# Altium schematic sheet Sheet1.SchDoc: 2015级电气唐伟康-毕业设计
size A3
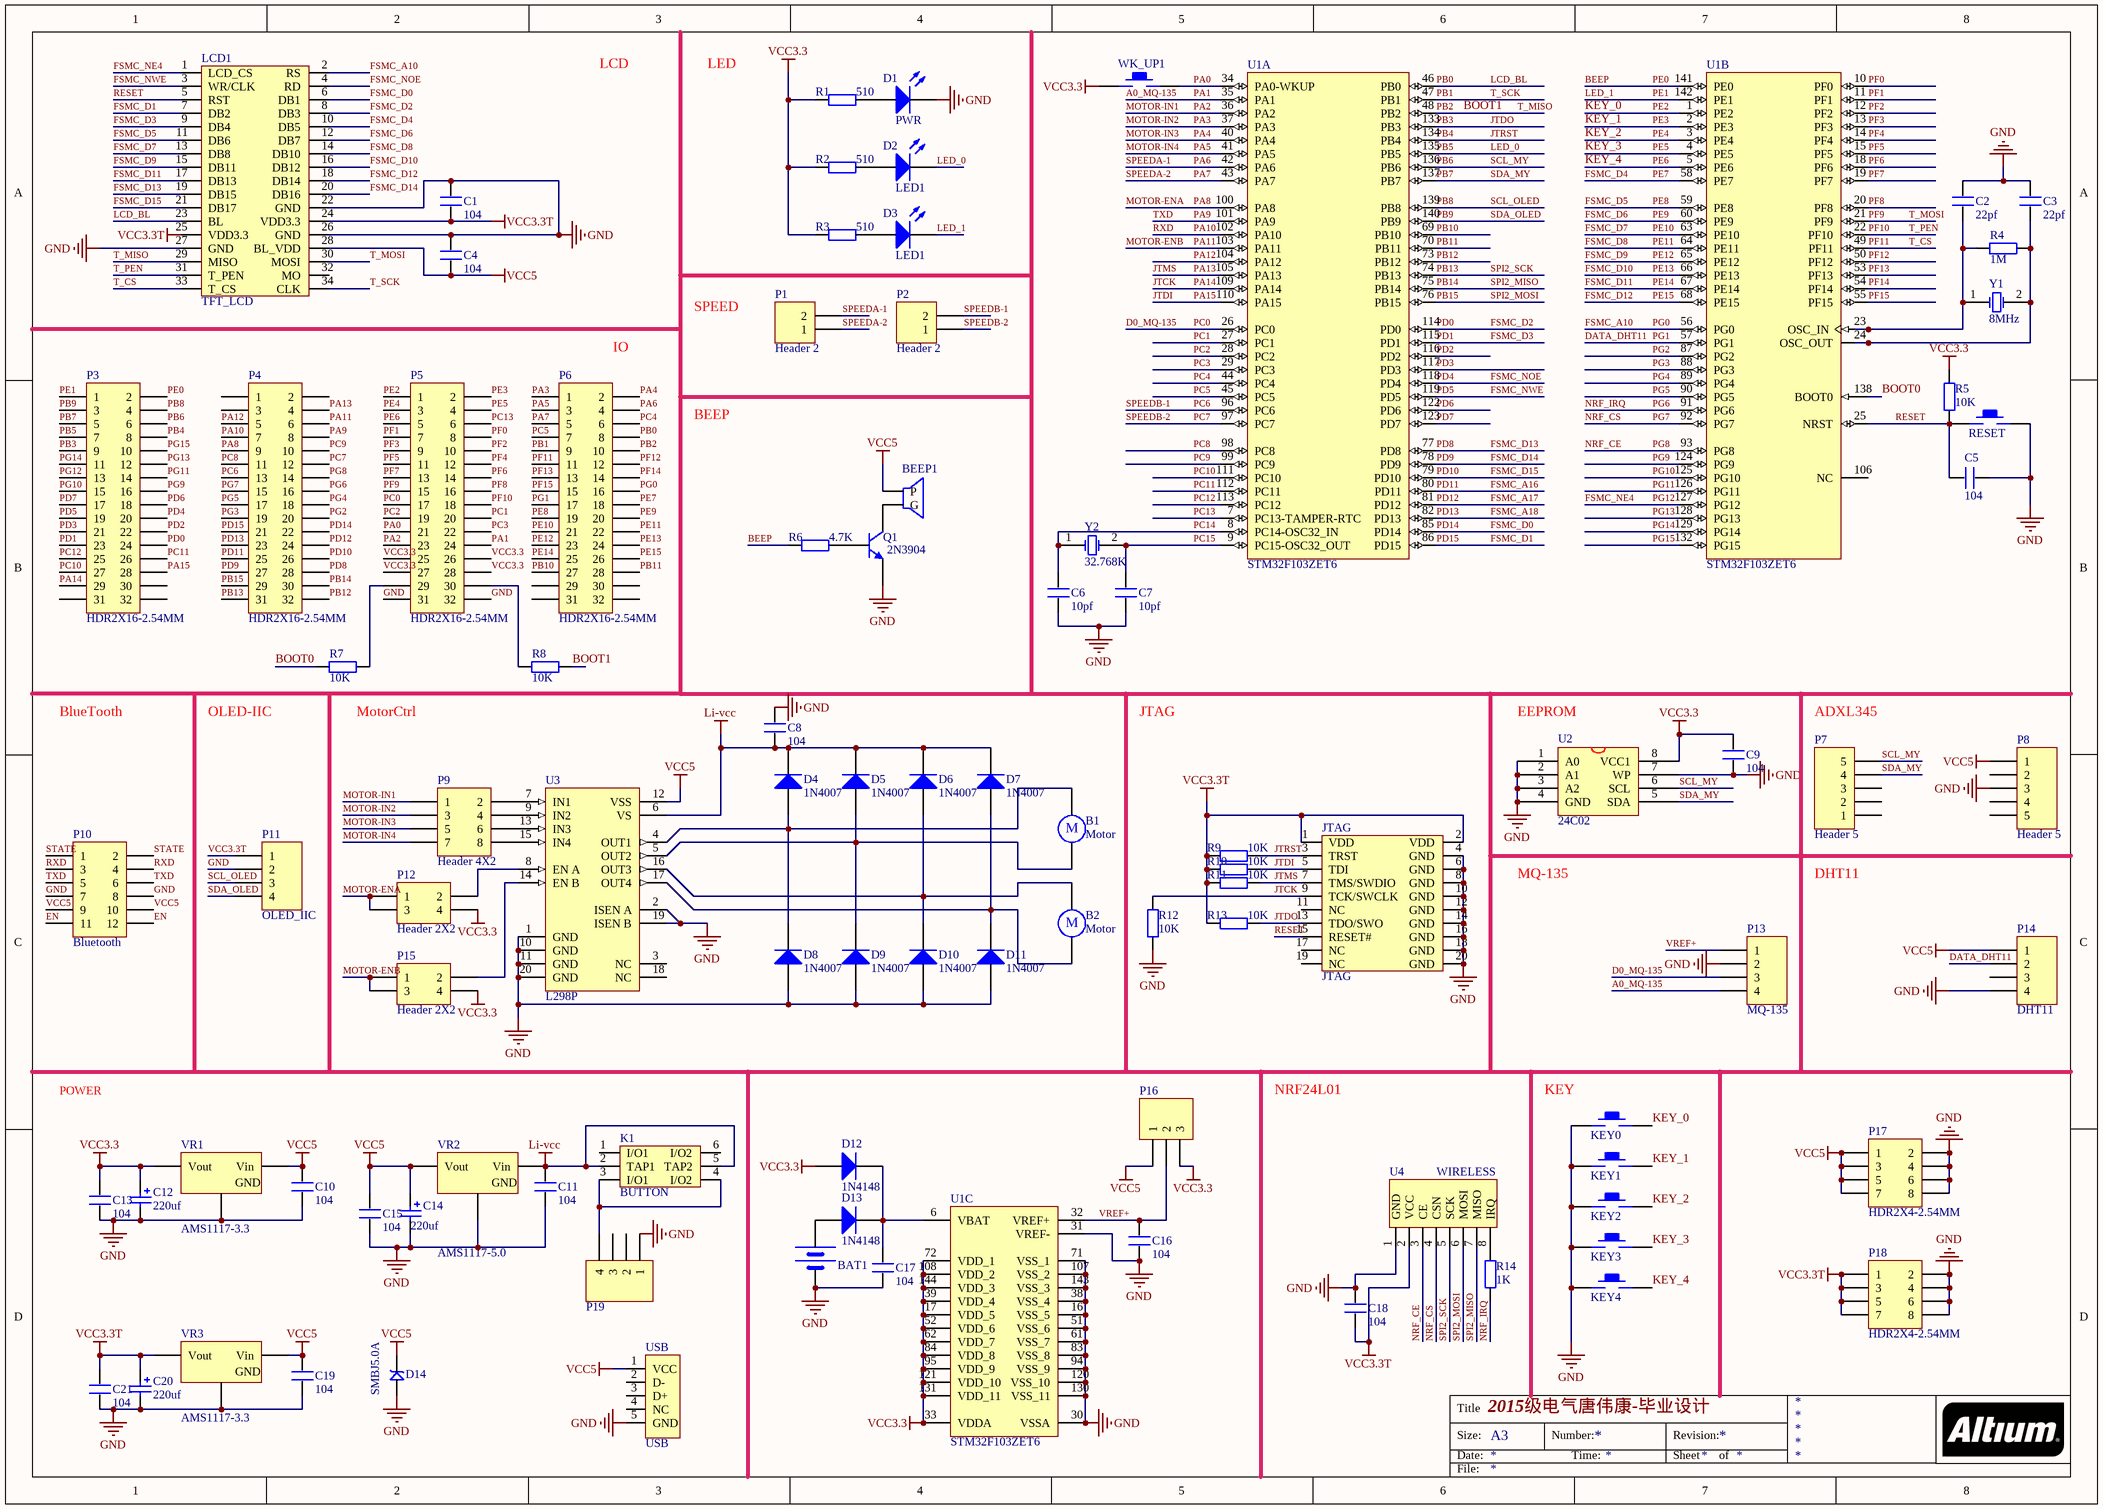
[diagram p0: Sheet1.SchDoc]

## Parts
B1  Motor  [RB5-10.5]
B2  Motor  [RB5-10.5]
BAT1  BATT  [BATM]  (value not drawn)
BEEP1  BEEP  [BELL-5]  (value not drawn)
C1  104  [0805]
C2  22pf  [0805]
C3  22pf  [0805]
C4  104  [0805]
C5  104  [0805]
C6  10pf  [0805]
C7  10pf  [0805]
C8  104  [0805]
C9  104  [0805]
C10  104  [0805]
C11  104  [0805]
C12  220uf  [C-DIP-6.3*15]
C13  104  [0805]
C14  220uf  [C-DIP-6.3*15]
C15  104  [0805]
C16  104  [0805]
C17  104  [0805]
C18  104  [0805]
C19  104  [0805]
C20  220uf  [C-DIP-6.3*15]
C21  104  [0805]
D1  PWR  [LED-1]
D2  LED1  [LED-1]
D3  LED1  [LED-1]
D4  1N4007  [DO-41]
D5  1N4007  [DO-41]
D6  1N4007  [DO-41]
D7  1N4007  [DO-41]
D8  1N4007  [DO-41]
D9  1N4007  [DO-41]
D10  1N4007  [DO-41]
D11  1N4007  [DO-41]
D12  1N4148  [DO-35]
D13  1N4148  [DO-35]
D14  SMBJ5.0A  [SMBJ]
JTAG  JTAG  [JTAG_20]
K1  BUTTON  [BTN8.5*8.5]
KEY0  KEY0  [KEY_M]  (value not drawn)
KEY1  KEY1  [KEY_M]  (value not drawn)
KEY2  KEY2  [KEY_M]  (value not drawn)
KEY3  KEY2  [KEY_M]  (value not drawn)
KEY4  KEY2  [KEY_M]  (value not drawn)
LCD1  TFT_LCD  [db2*17-4.3]
P1  Header 2  [HDR1X2]
P2  Header 2  [HDR1X2]
P3  HDR2X16-2.54MM  [HDR2X16-2.54MM]
P4  HDR2X16-2.54MM  [HDR2X16-2.54MM]
P5  HDR2X16-2.54MM  [HDR2X16-2.54MM]
P6  HDR2X16-2.54MM  [HDR2X16-2.54MM]
P7  Header 5  [HDR1X5]
P8  Header 5  [HDR1X5]
P9  Header 4X2  [HDR2X4]
P10  Bluetooth  [Header2X6-2.54MM]
P11  OLED_IIC  [Header1X4-2.54MM]
P12  Header 2X2  [HDR2X2]
P13  MQ-135  [Header1X4-2.54MM]
P14  DHT11  [Header1X4-2.54MM]
P15  Header 2X2  [HDR2X2]
P16  Header 3  [HDR1X3]  (value not drawn)
P17  HDR2X4-2.54MM  [HDR2X4-2.54MM]
P18  HDR2X4-2.54MM  [HDR2X4-2.54MM]
P19  Header1X4-2.54MM  [Header1X4-2.54MM]  (value not drawn)
Q1  2N3904  [TO-92A]
R1  value 510  [AXIAL-0.4]  (hidden comment: Res2)
R2  value 510  [AXIAL-0.4]  (hidden comment: Res2)
R3  value 510  [AXIAL-0.4]  (hidden comment: Res2)
R4  value 1M  [AXIAL-0.4]  (hidden comment: Res2)
R5  value 10K  [AXIAL-0.4]  (hidden comment: Res2)
R6  value 4.7K  [AXIAL-0.4]  (hidden comment: Res2)
R7  value 10K  [AXIAL-0.4]  (hidden comment: Res2)
R8  value 10K  [AXIAL-0.4]  (hidden comment: Res2)
R9  value 10K  [AXIAL-0.4]  (hidden comment: Res2)
R10  value 10K  [AXIAL-0.4]  (hidden comment: Res2)
R11  value 10K  [AXIAL-0.4]  (hidden comment: Res2)
R12  value 10K  [AXIAL-0.4]  (hidden comment: Res2)
R13  value 10K  [AXIAL-0.4]  (hidden comment: Res2)
R14  value 1K  [AXIAL-0.4]  (hidden comment: Res2)
RESET  RESET  [KEY_M]  (value not drawn)
U1  STM32F103ZET6  [STM-LQFP144_N]  (parts A,B,C of 3)
U2  24C02  [SOP-8]
U3  L298P  [PowerSO20_N]
U4  WIRELESS  [NRF24L01]
USB  USB  [USB/SM0.8-6H5]
VR1  AMS1117-3.3  [SOT-223]
VR2  AMS1117-5.0  [SOT-223]
VR3  AMS1117-3.3  [SOT-223]
WK_UP1  WK_UP  [KEY_M]  (value not drawn)
Y1  8MHz  [XTAL_US]
Y2  32.768K  [R38]

## Nets
GND: BAT1.2(GND) C1.2 C2.2 C3.2 C4.2 C5.2 C6.1 C7.1 C8.2 C9.2 C10.1 C11.1 C12.2 C13.1 C14.2 C15.1 C16.1 C17.1 C18.1 C19.1 C20.2 C21.1 D1.2(K) D8.1(A) D9.1(A) D10.1(A) D11.1(A) D14.1 JTAG.4(GND) JTAG.6(GND) JTAG.8(GND) JTAG.10(GND) JTAG.12(GND) JTAG.14(GND) JTAG.16(GND) JTAG.18(GND) JTAG.20(GND) KEY0.1 KEY1.1 KEY2.1 KEY3.1 KEY4.1 LCD1.22(GND) LCD1.26(GND) LCD1.27(GND) P5.31 P5.32 P8.3 P10.7 P10.8 P11.2 P13.2 P14.4 P17.2 P17.4 P17.6 P17.8 P18.2 P18.4 P18.6 P18.8 P19.1 Q1.1(E) R12.1 RESET.2 U1.16(VSS_5) U1.30(VSSA) U1.31(VREF-) U1.38(VSS_4) U1.51(VSS_6) U1.61(VSS_7) U1.71(VSS_1) U1.83(VSS_8) U1.94(VSS_9) U1.107(VSS_2) U1.120(VSS_10) U1.130(VSS_11) U1.143(VSS_3) U2.1(A0) U2.2(A1) U2.3(A2) U2.4(GND) U2.7(WP) U3.1(GND) U3.2(ISEN_A) U3.10(GND) U3.11(GND) U3.19(ISEN_B) U3.20(GND) U4.1(GND) USB.5(GND) VR1.1(GND) VR2.1(GND) VR3.1(GND)
Li-vcc: C8.1 C11.2 D4.2(K) D5.2(K) D6.2(K) D7.2(K) K1.2(TAP1) K1.5(TAP2) U3.6(VS) VR2.3(Vin)
VCC3.3: C9.1 C12.1 C13.2 D12.1(A) P5.25 P5.26 P5.27 P5.28 P12.4 P15.4 P16.3 R1.2 R2.2 R3.2 R5.2 U1.17(VDD_5) U1.33(VDDA) U1.39(VDD_4) U1.52(VDD_6) U1.62(VDD_7) U1.72(VDD_1) U1.84(VDD_8) U1.95(VDD_9) U1.108(VDD_2) U1.121(VDD_10) U1.131(VDD_11) U1.144(VDD_3) U2.8(VCC1) VR1.2(Vout) WK_UP1.1
VCC3.3T: C1.1 C18.2 C20.1 C21.2 JTAG.1(VDD) JTAG.2(VDD) LCD1.24(VDD3.3) LCD1.25(VDD3.3) P11.1 P18.1 P18.3 P18.5 P18.7 R9.2 R10.2 R11.2 R13.2 U4.2(VCC) VR3.2(Vout)
VCC5: BEEP1.1(P) C4.1 C10.2 C14.1 C15.2 C19.2 D14.2 LCD1.28(BL_VDD) P8.1 P10.9 P10.10 P14.1 P16.1 P17.1 P17.3 P17.5 P17.7 U3.12(VSS) USB.1(VCC) VR1.3(Vin) VR2.2(Vout) VR3.3(Vin)
A0_MQ-135: P5.24 P13.4 U1.35(PA1)  [also labelled PA1]
BEEP: P3.2 R6.2 U1.141(PE0)  [also labelled PE0]
BOOT0: R7.2 U1.138(BOOT0)
BOOT1: LCD1.29(MISO) P6.10 R8.1 U1.48(PB2)  [also labelled PB2, T_MISO]
D0_MQ-135: P5.17 P13.3 U1.26(PC0)  [also labelled PC0]
DATA_DHT11: P6.17 P14.2 U1.57(PG1)  [also labelled PG1]
EN: P10.11 P10.12
FSMC_A10: LCD1.2(RS) P6.16 U1.56(PG0)  [also labelled PG0]
FSMC_A16: P4.25 U1.80(PD11)  [also labelled PD11]
FSMC_A17: P4.24 U1.81(PD12)  [also labelled PD12]
FSMC_A18: P4.23 U1.82(PD13)  [also labelled PD13]
FSMC_D0: LCD1.6(DB1) P4.22 U1.85(PD14)  [also labelled PD14]
FSMC_D1: LCD1.7(DB2) P4.21 U1.86(PD15)  [also labelled PD15]
FSMC_D2: LCD1.8(DB3) P3.24 U1.114(PD0)  [also labelled PD0]
FSMC_D3: LCD1.9(DB4) P3.23 U1.115(PD1)  [also labelled PD1]
FSMC_D4: LCD1.10(DB5) P6.18 U1.58(PE7)  [also labelled PE7]
FSMC_D5: LCD1.11(DB6) P6.19 U1.59(PE8)  [also labelled PE8]
FSMC_D6: LCD1.12(DB7) P6.20 U1.60(PE9)  [also labelled PE9]
FSMC_D7: LCD1.13(DB8) P6.21 U1.63(PE10)  [also labelled PE10]
FSMC_D8: LCD1.14(DB10) P6.22 U1.64(PE11)  [also labelled PE11]
FSMC_D9: LCD1.15(DB11) P6.23 U1.65(PE12)  [also labelled PE12]
FSMC_D10: LCD1.16(DB12) P6.24 U1.66(PE13)  [also labelled PE13]
FSMC_D11: LCD1.17(DB13) P6.25 U1.67(PE14)  [also labelled PE14]
FSMC_D12: LCD1.18(DB14) P6.26 U1.68(PE15)  [also labelled PE15]
FSMC_D13: LCD1.19(DB15) P4.28 U1.77(PD8)  [also labelled PD8]
FSMC_D14: LCD1.20(DB16) P4.27 U1.78(PD9)  [also labelled PD9]
FSMC_D15: LCD1.21(DB17) P4.26 U1.79(PD10)  [also labelled PD10]
FSMC_NE4: LCD1.1(LCD_CS) P3.13 U1.127(PG12)  [also labelled PG12]
FSMC_NOE: LCD1.4(RD) P3.20 U1.118(PD4)  [also labelled PD4]
FSMC_NWE: LCD1.3(WR/CLK) P3.19 U1.119(PD5)  [also labelled PD5]
JTCK: JTAG.9(TCK/SWCLK) P3.29 R12.2 U1.109(PA14)  [also labelled PA14]
JTDI: JTAG.5(TDI) P3.28 R10.1 U1.110(PA15)  [also labelled PA15]
JTDO: JTAG.13(TDO/SWO) P3.9 R13.1 U1.133(PB3)  [also labelled PB3]
JTMS: JTAG.7(TMS/SWDIO) P4.4 R11.1 U1.105(PA13)  [also labelled PA13]
JTRST: JTAG.3(TRST) P3.8 R9.1 U1.134(PB4)  [also labelled PB4]
KEY_0: KEY0.2 P5.1 U1.1(PE2)  [also labelled PE2]
KEY_1: KEY1.2 P5.2 U1.2(PE3)  [also labelled PE3]
KEY_2: KEY2.2 P5.3 U1.3(PE4)  [also labelled PE4]
KEY_3: KEY3.2 P5.4 U1.4(PE5)  [also labelled PE5]
KEY_4: KEY4.2 P5.5 U1.5(PE6)  [also labelled PE6]
LCD_BL: LCD1.23(BL) P6.8 U1.46(PB0)  [also labelled PB0]
LED_0: D2.2(K) P3.7 U1.135(PB5)  [also labelled PB5]
LED_1: D3.2(K) P3.1 U1.142(PE1)  [also labelled PE1]
MOTOR-ENA: P4.9 P12.1 P12.3 U1.100(PA8)  [also labelled PA8]
MOTOR-ENB: P4.6 P15.1 P15.3 U1.103(PA11)  [also labelled PA11]
MOTOR-IN1: P5.23 P9.1 U1.36(PA2)  [also labelled PA2]
MOTOR-IN2: P6.1 P9.3 U1.37(PA3)  [also labelled PA3]
MOTOR-IN3: P6.2 P9.5 U1.40(PA4)  [also labelled PA4]
MOTOR-IN4: P6.3 P9.7 U1.41(PA5)  [also labelled PA5]
NRF_CE: P4.14 U1.93(PG8) U4.3(CE)  [also labelled PG8]
NRF_CS: P4.15 U1.92(PG7) U4.4(CSN)  [also labelled PG7]
NRF_IRQ: P4.16 R14.1 U1.91(PG6)  [also labelled PG6]
PA0: P5.21 U1.34(PA0-WKUP) WK_UP1.2
PA6: P1.2 P6.4 U1.42(PA6)  [also labelled SPEEDA-1]
PA7: P1.1 P6.5 U1.43(PA7)  [also labelled SPEEDA-2]
PA9: P4.8 P10.5 P10.6 U1.101(PA9)  [also labelled TXD]
PA10: P4.7 P10.3 P10.4 U1.102(PA10)  [also labelled RXD]
PA12: P4.5 U1.104(PA12)
PB1: LCD1.34(CLK) P6.9 U1.47(PB1)  [also labelled T_SCK]
PB6: P3.6 P7.5 U1.136(PB6) U2.6(SCL)  [also labelled SCL_MY]
PB7: P3.5 P7.4 U1.137(PB7) U2.5(SDA)  [also labelled SDA_MY]
PB8: P3.4 P11.3 U1.139(PB8)  [also labelled SCL_OLED]
PB9: P3.3 P11.4 U1.140(PB9)  [also labelled SDA_OLED]
PB10: P6.27 U1.69(PB10)
PB11: P6.28 U1.70(PB11)
PB12: P4.32 U1.73(PB12)
PB13: P4.31 U1.74(PB13) U4.5(SCK)  [also labelled SPI2_SCK]
PB14: P4.30 U1.75(PB14) U4.7(MISO)  [also labelled SPI2_MISO]
PB15: P4.29 U1.76(PB15) U4.6(MOSI)  [also labelled SPI2_MOSI]
PC1: P5.20 U1.27(PC1)
PC2: P5.19 U1.28(PC2)
PC3: P5.22 U1.29(PC3)
PC4: P6.6 U1.44(PC4)
PC5: P6.7 U1.45(PC5)
PC6: P2.2 P4.13 U1.96(PC6)  [also labelled SPEEDB-1]
PC7: P2.1 P4.12 U1.97(PC7)  [also labelled SPEEDB-2]
PC8: P4.11 U1.98(PC8)
PC9: P4.10 U1.99(PC9)
PC10: P3.27 U1.111(PC10)
PC11: P3.26 U1.112(PC11)
PC12: P3.25 U1.113(PC12)
PC13: P5.6 U1.7(PC13-TAMPER-RTC)
PC14: C6.2 U1.8(PC14-OSC32_IN) Y2.1(OSC1)
PC15: C7.2 U1.9(PC15-OSC32_OUT) Y2.2(OSC2)
PD2: P3.22 U1.116(PD2)
PD3: P3.21 U1.117(PD3)
PD6: P3.18 U1.122(PD6)
PD7: P3.17 U1.123(PD7)
PF0: P5.8 U1.10(PF0)
PF1: P5.7 U1.11(PF1)
PF2: P5.10 U1.12(PF2)
PF3: P5.9 U1.13(PF3)
PF4: P5.12 U1.14(PF4)
PF5: P5.11 U1.15(PF5)
PF6: P5.14 U1.18(PF6)
PF7: P5.13 U1.19(PF7)
PF8: P5.16 U1.20(PF8)
PF9: LCD1.30(MOSI) P5.15 U1.21(PF9)  [also labelled T_MOSI]
PF10: LCD1.31(T_PEN) P5.18 U1.22(PF10)  [also labelled T_PEN]
PF11: LCD1.33(T_CS) P6.11 U1.49(PF11)  [also labelled T_CS]
PF12: P6.12 U1.50(PF12)
PF13: P6.13 U1.53(PF13)
PF14: P6.14 U1.54(PF14)
PF15: P6.15 U1.55(PF15)
PG2: P4.20 U1.87(PG2)
PG3: P4.19 U1.88(PG3)
PG4: P4.18 U1.89(PG4)
PG5: P4.17 U1.90(PG5)
PG9: P3.16 U1.124(PG9)
PG10: P3.15 U1.125(PG10)
PG11: P3.14 U1.126(PG11)
PG13: P3.12 U1.128(PG13)
PG14: P3.11 U1.129(PG14)
PG15: P3.10 U1.132(PG15)
RESET: C5.1 JTAG.15(RESET#) LCD1.5(RST) R5.1 RESET.1 U1.25(NRST)
STATE: P10.1 P10.2
VREF+: C16.2 P13.1 P16.2 U1.32(VREF+)
NetB1_1: B1.1 D4.1(A) D8.2(K) U3.4(OUT1)
NetB1_2: B1.2 D5.1(A) D9.2(K) U3.5(OUT2)
NetB2_1: B2.1 D6.1(A) D10.2(K) U3.16(OUT3)
NetB2_2: B2.2 D7.1(A) D11.2(K) U3.17(OUT4)
NetBAT1_1: BAT1.1(VCC) D13.1(A)
NetBEEP1_2: BEEP1.2(G) Q1.3(C)
NetC2_1: C2.1 R4.2 U1.23(OSC_IN) Y1.1(OSC1)
NetC3_1: C3.1 R4.1 U1.24(OSC_OUT) Y1.2(OSC2)
NetC17_2: C17.2 D12.2(K) D13.2(K) U1.6(VBAT)
NetD1_1: D1.1(A) R1.1
NetD2_1: D2.1(A) R2.1
NetD3_1: D3.1(A) R3.1
NetK1_3: K1.3(I/O1) K1.4(I/O2) P19.4
NetP5_29: P5.29 R7.1
NetP5_30: P5.30 R8.2
NetP9_2: P9.2 U3.7(IN1)
NetP9_4: P9.4 U3.9(IN2)
NetP9_6: P9.6 U3.13(IN3)
NetP9_8: P9.8 U3.15(IN4)
NetP12_2: P12.2 U3.8(EN_A)
NetP15_2: P15.2 U3.14(EN_B)
NetQ1_2: Q1.2(B) R6.1
NetR14_2: R14.2 U4.8(IRQ)

Not connected (* = marked no-connect by the designer): JTAG 11(NC) 17(NC) 19(NC); K1 1(I/O1) 6(I/O2); LCD1 32(MO); P3 30 31 32; P4 1 2 3; P6 29 30 31 32; P7 1 2 3; P8 2 4 5; P14 3; P19 2 3; U1 106(NC); U3 3(NC) 18(NC); USB 2(D-) 3(D+) 4(NC)

## Notes on the sheet
- LCD
- LED
- SPEED
- (near P6) IO
- BEEP
- BlueTooth
- OLED-IIC
- (near R7) MotorCtrl
- JTAG
- (near U2) EEPROM
- (near P7) ADXL345
- MQ-135
- (near P7) DHT11
- POWER
- NRF24L01
- (near KEY0) KEY
- Title
- Size:
- Date:
- A3
- Number:
- Time:
- Revision:
- Sheet
- of
- File:
- (in symbol Motor) M

## Library data of the parts
B1 B2 = Motor: Motor, General Kind; Published: 24-Mar-1999; LatestRevisionDate: 17-Jul-2002; LatestRevisionNote: Re-released for DXP Platform.; PackageReference: RB5-10.5; Publisher: Altium Limited; PackageDescription: Capacitor (Radial); 2 Leads
BAT1 = BAT
C1-C7 C9 C13 C15 C17-C19 C21 = C
C8 C10 C11 C16 = C: 10uf
C12 C14 C20 = C-DIP-6.3*15: *C-DIP-6.3*15
D1-D3 = LED1: Typical RED GaAs LED; Published: 8-Jun-2000; LatestRevisionDate: 08-Jul-2005; LatestRevisionNote: Mech Layer 1 removed.; PackageReference: LED-1; Publisher: Altium Limited; PackageDescription: LED; 2 Leads
D4-D11 = Diode 1N4007: 1 Amp General Purpose Rectifier; Published: 8-Jun-2000; LatestRevisionDate: 17-Jul-2002; LatestRevisionNote: Re-released for DXP Platform.; DatasheetVersion: 1998; PackageVersion: Aug-1999; PackageReference: DO-41; Publisher: Altium Limited; PackageDescription: Diode, Axial; Body 5.2 x 2.7 mm (LxDia. max), Lead Dia. 0.86 mm (max); Code_JEDEC: DO-204-AL; ComponentLink1Description: Manufacturer Link; ComponentLink1URL: http://www.fairchildsemi.com/; ComponentLink2Description: Datasheet; ComponentLink2URL: http://www.fairchildsemi.com/ds/1N%2F1N4001.pdf
D12 D13 = Diode 1N4148: High Conductance Fast Diode; Published: 8-Jun-2000; LatestRevisionDate: 17-Jul-2002; LatestRevisionNote: Re-released for DXP Platform.; DatasheetVersion: 1997; PackageReference: DO-35; Publisher: Altium Limited; PackageDescription: Diode, Axial; Body 3.8 x 1.9 mm (LxDia. max), Lead Dia. 0.53 mm (max); Code_JEDEC: DO-204-AH; ComponentLink1Description: Manufacturer Link; ComponentLink1URL: http://www.fairchildsemi.com/; ComponentLink2Description: Datasheet; ComponentLink2URL: http://www.fairchildsemi.com/ds/1N%2F1N4148.pdf
D14 = SMBJ: TVS
KEY0-KEY4 RESET WK_UP1 = KEY_M
P1 P2 = Header 2: Header, 2-Pin; LatestRevisionDate: 17-Jul-2002; LatestRevisionNote: Re-released for DXP Platform.; Publisher: Altium Limited
P7 P8 = Header 5: Header, 5-Pin; LatestRevisionDate: 17-Jul-2002; LatestRevisionNote: Re-released for DXP Platform.; Publisher: Altium Limited
P9 = Header 4X2: Header, 4-Pin, Dual row; LatestRevisionDate: 17-Jul-2002; LatestRevisionNote: Re-released for DXP Platform.; Publisher: Altium Limited
P10 = Header2X6-2.54MM: Designer: www.dratk.com
P11 P13 P14 = Header1X4-2.54MM: Designer: www.dratk.com
P12 P15 = Header 2X2: Header, 2-Pin, Dual row; LatestRevisionDate: 17-Jul-2002; LatestRevisionNote: Re-released for DXP Platform.; Publisher: Altium Limited
P16 = Header 3: Header, 3-Pin; LatestRevisionDate: 17-Jul-2002; LatestRevisionNote: Re-released for DXP Platform.; Publisher: Altium Limited
Q1 = 2N3904: NPN General Purpose Amplifier; Published: 8-Jun-2000; LatestRevisionDate: 15-Jan-2003; LatestRevisionNote: PCB Footprint 'BCY-W3/D4.7' replaced; DatasheetVersion: 1997; PackageVersion: Sep-1998; PackageReference: TO-92A; Publisher: Altium Limited; PackageDescription: TO, Flat Index; 3 In-Line, Axial Leads; Body Dia. 4.5mm; Leads 0.51 x 0.48 mm (max); ComponentLink1Description: Manufacturer Link; ComponentLink1URL: http://www.fairchildsemi.com/; ComponentLink2Description: Datasheet; ComponentLink2URL: http://www.fairchildsemi.com/ds/2N%2F2N3904.pdf
R1-R14 = Res2: Resistor; Published: 8-Jun-2000; LatestRevisionDate: 17-Jul-2002; LatestRevisionNote: Re-released for DXP Platform.; PackageReference: AXIAL-0.4; Publisher: Altium Limited; PackageDescription: Axial Device, Thru-Hole; 2 Leads; 0.4 in Pin Spacing
U1 = STM32F103ZET6: ARM Cortex-M3 32-bit MCU, 512 KB Flash, 64 KB Internal RAM, 112 I/Os, 144-pin LQFP, -40 to 85 degC, Tray; A/D Converter: 3x12-bit (21 Channel); D/A Converter: 2x12-bit (2 Channel); FLASH Size (Prog) (kB): 512; I/Os (High Current): 112; Internal RAM Size (kB): 64; Operating Frequency(F) (Processor speed) (MHz): 72; Supply Voltage(Vcc) min (V): 2; DatasheetVersion: Rev. 8; PackageVersion: Rev. 4, 06/2013; PackageReference: LQFP144; PackageDescription: 144-Pin Low Profile Quad Flat Package, 20 x 20 mm Body, 0.5 mm Pitch; Supplier 1: Digi-Key; Supplier Part Number 1: 497-6442-ND; Supplier 2: Farnell; Supplier Part Number 2: 1624145; Supplier 3: Newark; Supplier Part Number 3: 57P1270; Supplier 4: Mouser; Supplier Part Number 4: 511-STM32F103ZET6; Core: ARM Cortex-M3; Packing: Tray; Mounting Technology: Surface Mount; PartNumber: STM32F103ZET6; ComponentLink1Description: Manufacturer URL; ComponentLink1URL: http://www.st.com/web/en/home.html; ComponentLink2Description: Datasheet; ComponentLink2URL: http://www.st.com/st-web-ui/static/active/en/resource/technical/document/datasheet/CD00191185.pdf; ComponentLink3Description: Package Specification; ComponentLink3URL: http://www.st.com/st-web-ui/static/active/en/resource/technical/document/datasheet/DM00037051.pdf
U2 = 24C256
U3 = L298P: Dual Full Bridge Driver; Published: 8-Jun-2000; LatestRevisionDate: 13-Apr-2006; LatestRevisionNote: IPC-7351 Footprint Added.; DatasheetVersion: Jul-1999; PackageVersion: May-1998; PackageReference: POWERSO20; Publisher: Altium Limited; PackageDescription: 20-Pin Small Outline Package 1.27 mm Pitch; Code_JEDEC: MO-166; ComponentLink1Description: Manufacturer Link; ComponentLink1URL: http://www.st.com/; ComponentLink2Description: Datasheet; ComponentLink2URL: http://www.st.com/stonline/products/literature/ds/1773/l298.pdf
U4 = NRF24L01
USB = USB5
VR1 VR3 = SOT-223 AMS1117-3.3: 低压差线性稳压(LDO); ComponentLink1Description: 供应商链接; ComponentLink1URL: http://www.szlcsc.com/product/details_6652.html; Package: SOT-223; Supplier: LC; SuppliersPartNumber: C6186
VR2 = SOT-223 AMS1117-5.0: 低压差线性稳压(LDO); ComponentLink1Description: 供应商链接; ComponentLink1URL: http://www.szlcsc.com/product/details_6653.html; Package: SOT-223; Supplier: LC; SuppliersPartNumber: C6187
Y1 Y2 = XTAL: Crystal Oscillator; Published: 8-Jun-2000; LatestRevisionDate: 17-Jul-2002; LatestRevisionNote: Re-released for DXP Platform.; Publisher: Altium Limited
  Y2: PackageReference: R38; PackageDescription: Crystal, Thru-Hole; 2 Leads; Body 3.1 x 8.2 mm (Dia.xH)
P3-P6 = HDR2X16-2.54MM: Designer: www.dratk.com
P17 P18 = HDR2X4-2.54MM: Designer: www.dratk.com
P19 = Header1X4-2.54MM: Designer: www.dratk.com